# EAGLE schematic SmartThermostat_V0 (EAGLE 8.5.2)
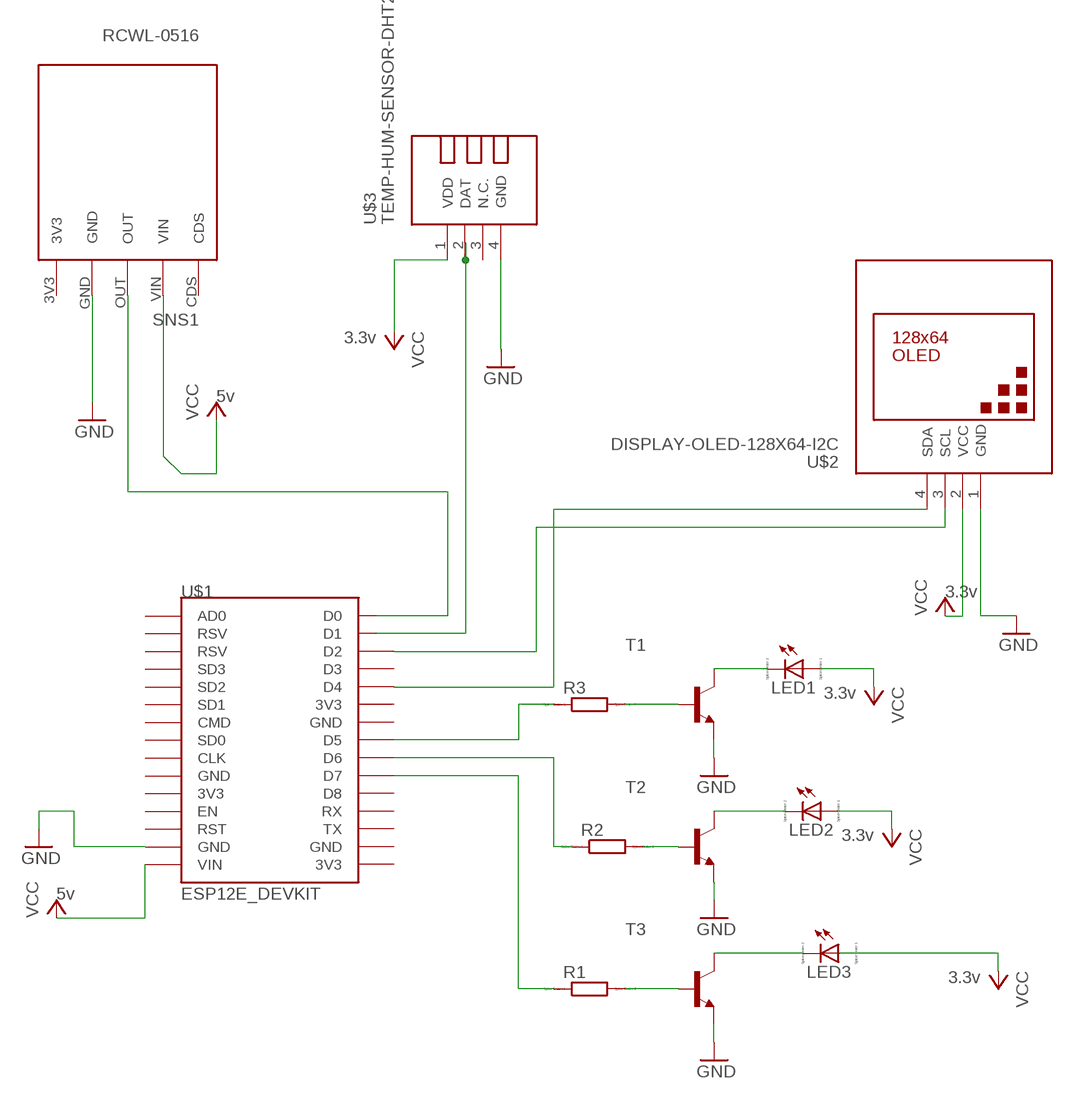
[diagram p0: schematic, sheet 1]

## Parts
LED1  LED_ELD260  [LED_LD260]
LED2  LED_ELD260  [LED_LD260]
LED3  LED_ELD260  [LED_LD260]
R1  R0204/7  [0204/7]
R2  R0204/7  [0204/7]
R3  R0204/7  [0204/7]
SNS1  RCWL-0516  [RCWL-0516]
T1  2N2222-NPN-TO92-EBC  [TO92-EBC]
T2  2N2222-NPN-TO92-EBC  [TO92-EBC]
T3  2N2222-NPN-TO92-EBC  [TO92-EBC]
U$1  ESP12E_DEVKIT  [ESP12E_DEVKIT]
U$2  DISPLAY-OLED-128X64-I2C  [DISPLAY-OLED-128X64-I2C]
U$3  TEMP-HUM-SENSOR-DHT22  [TEMP-HUM-SENSOR-DHT22]

## Nets
GND: SNS1.GND T1.E T2.E T3.E U$1.GND@1(GND) U$2.1(GND) U$3.4(GND)
N$1: U$2.2(VCC) ; supply symbol labelled VCC
N$2: U$1.D4 U$2.4(SDA)
N$3: U$1.D2 U$2.3(SCL)
N$4: SNS1.OUT
N$5: U$3.2(DAT)
N$6: R1.2 T3.B
N$7: R2.2 T2.B
N$8: R3.2 T1.B
N$9: LED3.K(C) T3.C
N$10: LED2.K(C) T2.C
N$11: LED1.K(C) T1.C
N$12: R3.1 U$1.D5
N$13: R2.1 U$1.D6
N$14: R1.1 U$1.D7
VCC: LED1.A LED2.A SNS1.VIN U$1.VIN U$3.1(VDD)
Unconnected: LED3.A SNS1.3V3 SNS1.CDS U$1.3V3@0(3V3) U$1.3V3@1(3V3) U$1.3V3@2(3V3) U$1.AD0 U$1.CLK U$1.CMD U$1.D0 U$1.D1 U$1.D3 U$1.D8 U$1.EN U$1.GND@0(GND) U$1.GND@2(GND) U$1.GND@3(GND) U$1.RST U$1.RSV@0(RSV) U$1.RSV@1(RSV) U$1.RX U$1.SD0 U$1.SD1 U$1.SD2 U$1.SD3 U$1.TX U$3.3(N.C.)

## Library data of the parts
LED1-LED3 = eagle-ltspice:LED_E: LED Source: http://www.osram.convergy.de Source: www.luxeon.com Source: www.kingbright.com; SPICEMODEL: NONE; SPICEPREFIX: D; SPICETYPE: diode
R1-R3 = eagle-ltspice:R: RESISTOR, European symbol; SPICEMODEL: NONE; SPICEPREFIX: R
SNS1 = RCWL-0516:RCWL-0516
T1-T3 = transistor-neu-to92:*-NPN-: NPN Transistror
U$1 = ESP12E_DEVKIT:ESP12E_DEVKIT: ESP12E DEVKIT BOARD
U$2 = diy-modules:DISPLAY-OLED-128X64-I2C: 128x64 Dot Matrix OLED Module based on SSD1306 chip Variant with I2C interface More details available here: http://www.instructables.com/id/Monochrome-096-i2c-OLED-display-with-arduino-SSD13/ SSD1306 datasheet: https://cdn-shop.adafruit.com/datasheets/SSD1306.pdf Click here to find device on ebay.com <http://www.ebay.com/sch/oled+display+128x64+iic> Note: There are two variants: I2C and SPI. Search for the proper version.
U$3 = diy-modules:TEMP-HUM-SENSOR-DHT22: DHT22 - digital humidity & temperature sensor Also known as: AM2302 AM2302 datasheet available here: http://akizukidenshi.com/download/ds/aosong/AM2302.pdf Click here to find device on ebay.com <http://www.ebay.com/sch/dht22+digital+sensor>